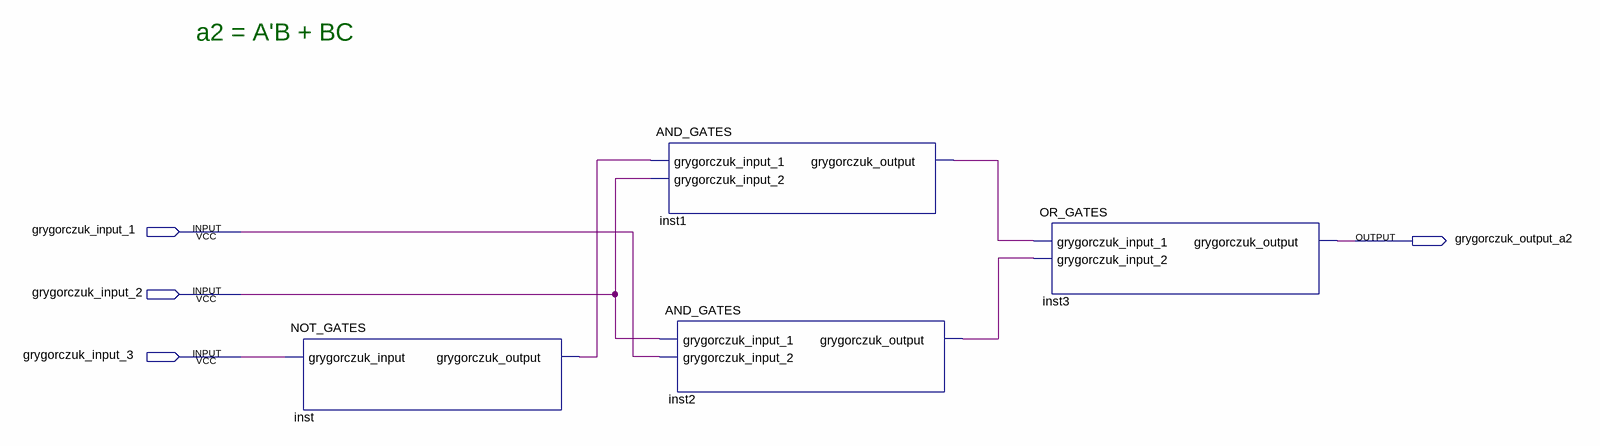
[diagram p0: schematic sheet]
// Quartus schematic RESET_A2.bdf as structural Verilog: 4 symbols, 4 pins
module RESET_A2 (
  input  grygorczuk_input_1,
  input  grygorczuk_input_2,
  input  grygorczuk_input_3,
  output grygorczuk_output_a2
);

  wire inst1_grygorczuk_output, inst2_grygorczuk_output, inst_grygorczuk_output;

  NOT_GATES inst (.grygorczuk_input(grygorczuk_input_3), .grygorczuk_output(inst_grygorczuk_output));
  AND_GATES inst1 (
    .grygorczuk_input_1(inst_grygorczuk_output), .grygorczuk_input_2(grygorczuk_input_2),
    .grygorczuk_output(inst1_grygorczuk_output));
  AND_GATES inst2 (
    .grygorczuk_input_1(grygorczuk_input_2), .grygorczuk_input_2(grygorczuk_input_1),
    .grygorczuk_output(inst2_grygorczuk_output));
  OR_GATES inst3 (
    .grygorczuk_input_1(inst1_grygorczuk_output), .grygorczuk_input_2(inst2_grygorczuk_output),
    .grygorczuk_output(grygorczuk_output_a2));

  // Notes on the sheet:
  //   a2 = A'B + BC
endmodule
